# EAGLE design m2101-psu-dcdc (EAGLE 7.5.0)
Assembly variants: 9V-36V Input (Pos ON), 9V-36V Input (Neg ON), +15V/0/-15V Input
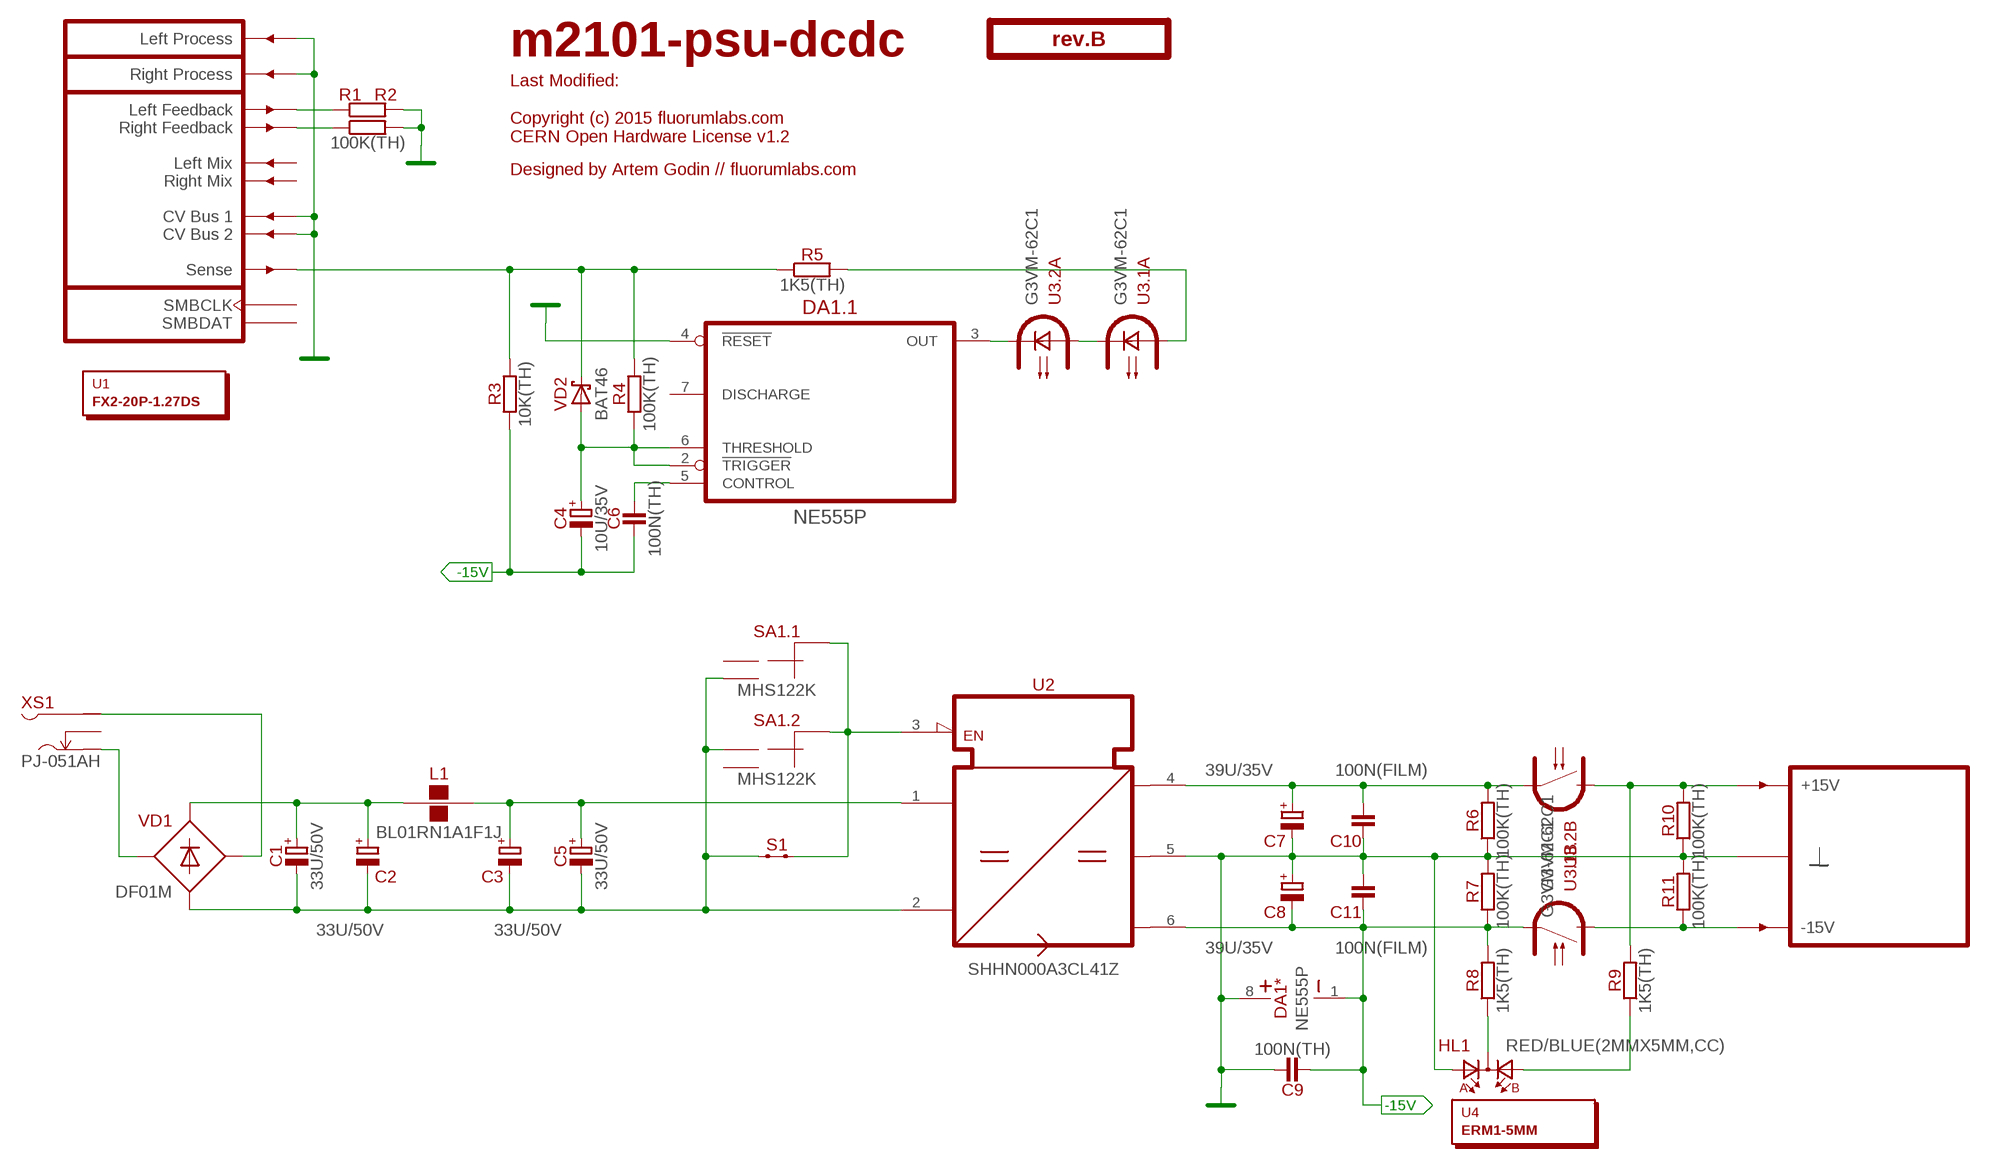
[diagram p0: schematic, sheet 1]

## Parts
C1  33U/50V  [E3,5-8]
C2  33U/50V  [E3,5-8]  (not fitted in variant +15V/0/-15V Input)
C3  33U/50V  [E3,5-8]  (not fitted in variant +15V/0/-15V Input)
C4  10U/35V  [E2-5]
C5  33U/50V  [E3,5-8]
C6  100N(TH)  [C050-024X044]
C7  39U/35V  [E3,5-8]
C8  39U/35V  [E3,5-8]
C9  100N(TH)  [C050-024X044]
C10  100N(FILM)  [C050-025X075]
C11  100N(FILM)  [C050-025X075]
DA1  NE555P  [DIP-8]
HL1  RED/BLUE(2MMX5MM,CC)  [LED2X5-3PIN]
L1  BL01RN1A1F1J  [BL01RN1A]  (not fitted in variant +15V/0/-15V Input)
O1  Designed by Artem Godin // fluorumlabs.com  TITLE  [EMPTY]
PCB1  rev.B  ST2-BOARD-50-PSU  [ST2-BOARD-50-PSU]
R1  100K(TH)  [R-0207/10]
R2  100K(TH)  [R-0207/10]
R3  10K(TH)  [R-0207/10]
R4  100K(TH)  [R-0207/10]
R5  1K5(TH)  [R-0207/10]
R6  100K(TH)  [R-0207/10]
R7  100K(TH)  [R-0207/10]
R8  1K5(TH)  [R-0207/10]
R9  1K5(TH)  [R-0207/10]
R10  100K(TH)  [R-0207/10]
R11  100K(TH)  [R-0207/10]
S1  JUMPER-1POS-SOLDER  [JP1-SOLDER]
SA1  MHS122K  [APEM-MHS122K]
U1  FX2-20P-1.27DS  [EMPTY]
U2  SHHN000A3CL41Z  [DC/DC-C1]  (not fitted in variant +15V/0/-15V Input)
U3  G3VM-62C1  [DIL08]
U4  ERM1-5MM  [EMPTY]
VD1  DF01M  [MDIP-4]
VD2  BAT46  [DO35-7]
XS1  PJ-051AH  [PJ-051AH]

## Nets
-15V: C4.- C6.1 C8.- C9.1 C11.1 DA1.1(*:V-) R3.1 R7.1 R8.2 U2.6(V-) U3.7(.1B:S2)
GND: C7.- C8.+ C9.2 C10.1 C11.2 DA1.4(.1:!RESET) DA1.8(*:V+) HL1.A1 PCB1.ACV1'(CV1') PCB1.ACV2'(CV2') PCB1.B4'(GND) PCB1.B5'(GND) PCB1.B6'(GND) PCB1.B7'(GND) PCB1.B8'(GND) PCB1.BOUTL'(OUTL) PCB1.BOUTR'(OUTR) R1.2 R2.2 R6.1 R7.2 R10.1 R11.2 U2.5(GND)
N$1: R5.2 U3.1(.1A:A)
N$2: VD1.1(AC1) XS1.3(S)
N$3: C1.- C2.- C3.- C5.- S1.1 SA1.1' SA1.2 U2.2(IN-) VD1.4(A)
N$4: PCB1.ALFBK'(LFBK') R1.1
N$5: PCB1.ARFBK'(RFBK') R2.1
N$6: C6.2 DA1.5(.1:CONTROL)
N$7: DA1.3(.1:OUT) U3.4(.2A:C)
N$8: PCB1.A+15'(P+15V) PCB1.B+15'(P+15V) R9.2 R10.2 U3.6(.2B:S1)
N$9: U3.2(.1A:C) U3.3(.2A:A)
N$10: C4.+ DA1.2(.1:!TRIGGER) DA1.6(.1:THRESHOLD) R4.1 VD2.A
N$11: VD1.2(AC2) XS1.1(P)
N$12: PCB1.A-15'(P-15V) PCB1.B-15'(P-15V) R11.1 U3.8(.1B:S1)
N$13: HL1.K R8.1
N$14: HL1.A2 R9.1
N$15: C7.+ C10.2 R6.2 U2.4(V+) U3.5(.2B:S2)
N$16: S1.2 SA1.CMN'(.2:CM) SA1.CMN(.1:CM) U2.3(EN)
N$20: C1.+ C2.+ L1.1 VD1.3(C)
N$22: C3.+ C5.+ L1.2 U2.1(IN+)
SENSE: PCB1.BSENSE'(SENSE') R3.2 R4.2 R5.1 VD2.C
Unconnected: DA1.7(.1:DISCHARGE) PCB1.ALMIX'(LMIX') PCB1.ARMIX'(RMIX') PCB1.ASMBCLK'(SMBCLK) PCB1.ASMBDAT'(SMBDAT) SA1.1 SA1.2' XS1.2(SS)

## Library data of the parts
C1-C3 C5 = capacitors-electrolytic:?; MOUSER: 661-EKZE500ELL330MH0
C4 = capacitors-electrolytic:?; MOUSER: 647-USW1V100MDD
C6 C9 = capacitors:?; MOUSER: 81-RCER71H104K0A2H3B
C7 C8 = capacitors-electrolytic:?; MOUSER: 667-35SEPF39M
C10 C11 = capacitors:?; MOUSER: 505-MKS2.1/63/5
DA1 = ic-logic:NE555?; MOUSER: 595-NE555P
HL1 = optoelectronics:?(2MMX5MM,CC)
L1 = inductors:BL01RN1A?; MOUSER: 81-BL01RN1A1F1J
O1 = text:TITLE
PCB1 = module-footprints:ST2-BOARD-50-PSU
R1 R2 R4 R6 R7 R10 R11 = resistors:?; MOUSER: 71-RN55D-F-100K
R3 = resistors:?; MOUSER: 71-RN55D-F-10K
R5 R8 R9 = resistors:?; MOUSER: 71-CCF071K50GKE36
S1 = switches:JUMPER-1POS-SOLDER
SA1 = switches:MHS122K; MOUSER: 642-MHS122K
U1 = hardware:?; MOUSER: 798-FX2-20P-1.27DS71
U2 = regulators-switch-mode:SHHN000A3CL41Z; MOUSER: 894-SHHN000A3CL41Z
U3 = optoelectronics:G3VM-?2C; MOUSER: 653-G3VM-62C1
U4 = hardware:?
VD1 = diodes:DF?M; MOUSER: 512-DF01M
VD2 = diodes-schottky:?; MOUSER: 511-BAT46
XS1 = connectors:PJ-051?; MOUSER: 490-PJ-051AH

## Board
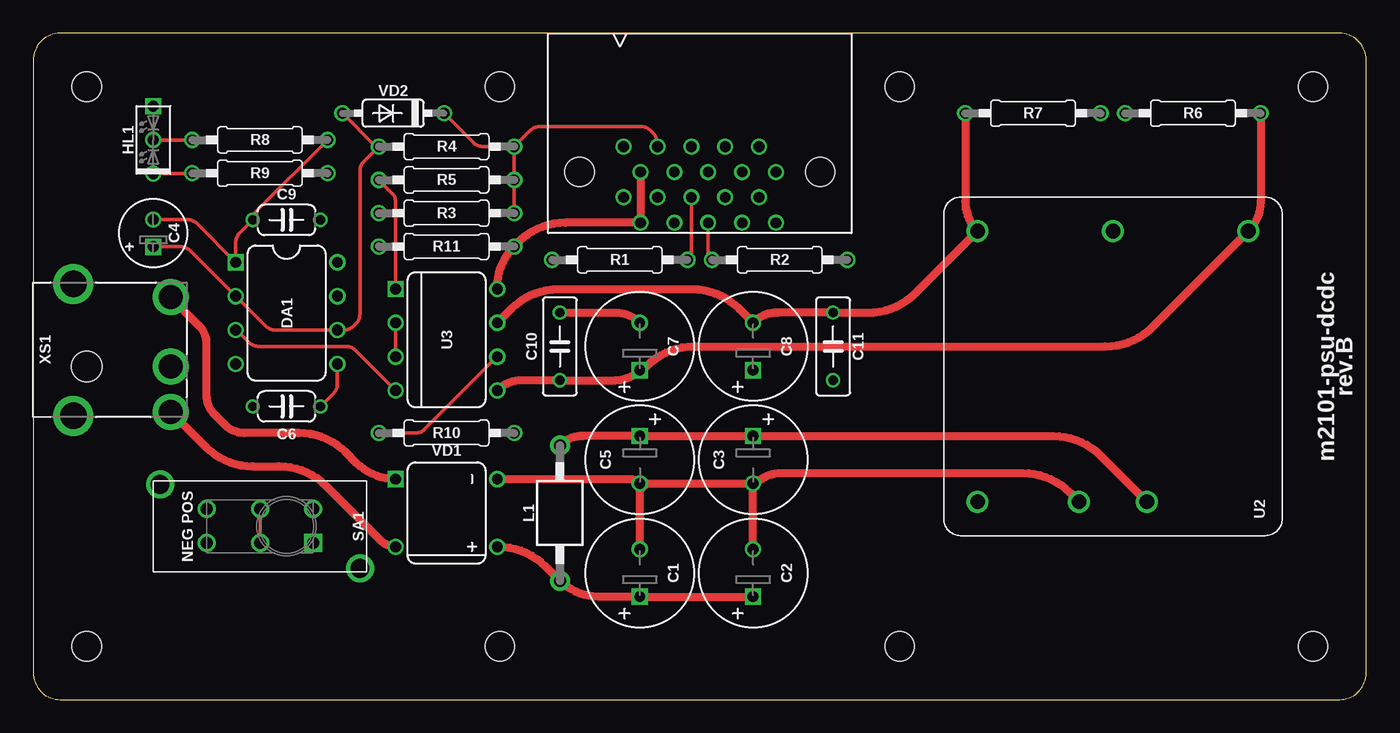
[diagram p1: board, top side]
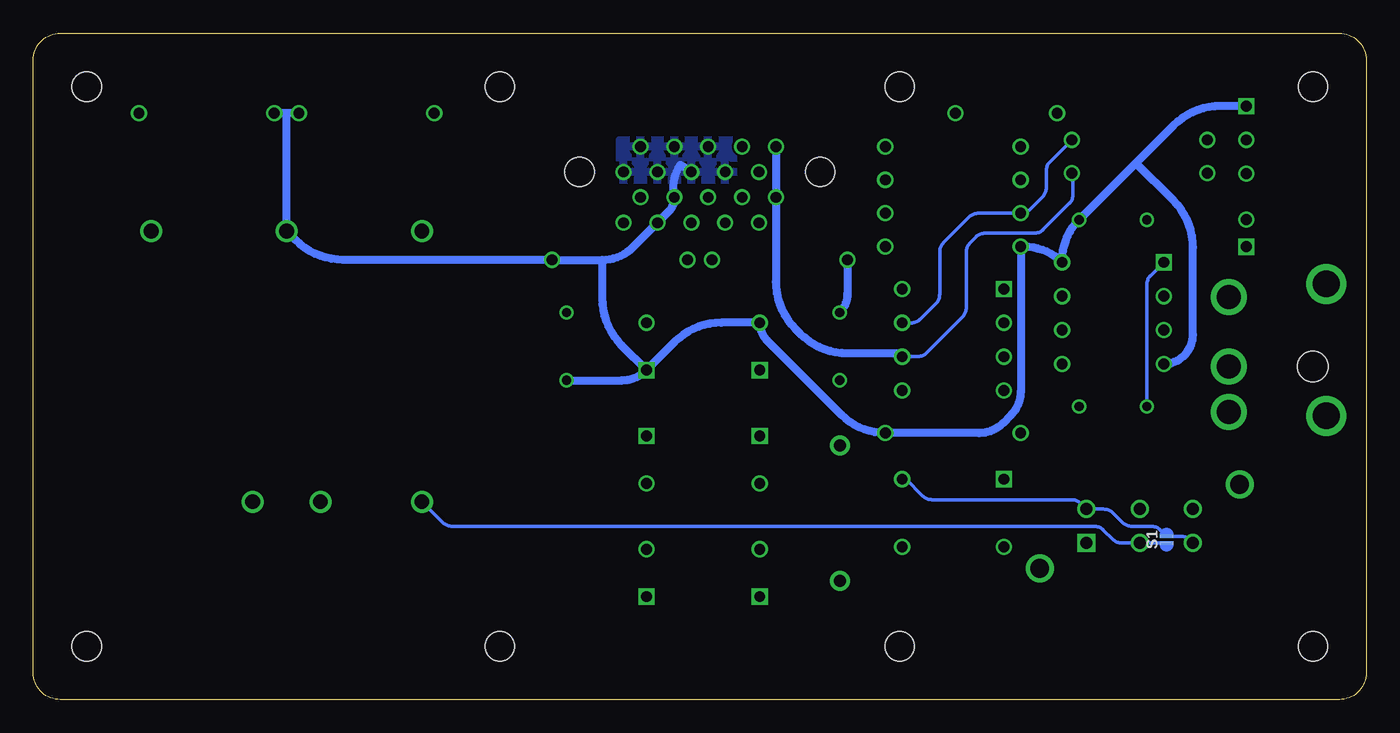
[diagram p2: board, bottom side, seen from below]

Size 100 x 50 mm. Coordinates in mm from the lower left corner, seen from the top.
Outline: 0,48 0,2 arc90 2,0 98,0 arc90 100,2 100,48 arc90 98,50 2,50 arc90 0,48
Copper layers (1*16): Top 0.0356mm / dielectric 1.5011mm / Bottom 0.0356mm
Design rules "LaenPCBOrder": minimum track width 6mil, minimum drill 13mil, track to track 6mil, track to pad 6mil, pad to pad 6mil, via to via 6mil, smd to smd 6mil, copper to edge 15mil, drill to drill 6mil, minimum pad ring 7mil, minimum via ring 7mil, stop-mask expansion 3mil, vias tented up to drill 0mil, thermal gap 10mil

### Footprints (pad centres in the part's own frame; a part is rotated, then mirrored left to right if it is on the bottom)
E3,5-8 = drill 0.813 square: + -1.778,0 | drill 0.813: - 1.778,0
E2-5 = drill 0.813 square: + -1.016,0 | drill 0.813: - 1.016,0
C050-024X044 = drill 0.7: 1 -2.54,0; 2 2.54,0
C050-025X075 = drill 0.7: 1 -2.54,0; 2 2.54,0
DIP-8 = drill 0.813 square: 1 -3.81,-3.81 | drill 0.813: 2 -1.27,-3.81; 3 1.27,-3.81; 4 3.81,-3.81; 5 3.81,3.81; 6 1.27,3.81; 7 -1.27,3.81; 8 -3.81,3.81
LED2X5-3PIN = drill 0.813 square: A1 -2.54,0 | drill 0.813: A2 2.54,0; K 0,0
BL01RN1A = drill 0.9 pad 1.5: 1 -5.08,0; 2 5.08,0
ST2-BOARD-50-PSU = drill 0.8: A+15' 44.285,37.69; A-15' 45.555,35.785; ACV1' 51.905,37.69; ACV2' 53.175,35.785; ALFBK' 49.365,37.69; ALMIX' 46.825,37.69; ARFBK' 50.635,35.785; ARMIX' 48.095,35.785; ASMBCLK' 55.715,35.785; ASMBDAT' 54.445,37.69; B4' 48.095,39.595; B5' 49.365,41.5; B6' 50.635,39.595; B7' 51.905,41.5; B8' 53.175,39.595; B+15' 44.285,41.5; B-15' 45.555,39.595; BOUTL' 54.445,41.5; BOUTR' 55.715,39.595; BSENSE' 46.825,41.5 | hole 2.2: 4,4; 4,46; 96,4; 96,46; 35,46; 65,46; 65,4; 35,4; 40.975,39.595; 59.025,39.595
R-0207/10 = drill 0.813: 1 -5.08,0; 2 5.08,0
JP1-SOLDER = smd 0.254 x 1.016: 1 -0.254,0.026; 2 0.254,0.026
APEM-MHS122K = drill 0.9 square: 1 -4,1.25 | drill 0.9: 1' -4,-1.29; 2 4,1.25; 2' 4,-1.29; CMN 0,1.25; CMN' 0,-1.29 | drill 1.4: S1 -7.5,3.15; S2 7.5,-3.15
DC/DC-C1 = drill 1.1: 1 -10.16,-2.54; 2 -10.16,2.54; 3 -10.16,10.16; 4 10.16,-10.16; 5 10.16,0; 6 10.16,10.16
DIL08 = drill 0.813 square: 1 -3.81,-3.81 | drill 0.813: 2 -1.27,-3.81; 3 1.27,-3.81; 4 3.81,-3.81; 5 3.81,3.81; 6 1.27,3.81; 7 -1.27,3.81; 8 -3.81,3.81
MDIP-4 = drill 0.813 square: 1 -2.54,-3.81 | drill 0.813: 2 2.54,-3.81; 3 2.54,3.81; 4 -2.54,3.81
DO35-7 = drill 0.813: A 3.81,0; C -3.81,0
PJ-051AH = drill 1.8: 1 10.3,-3.4; 2 10.3,0; 3 10.3,5.2 | drill 2: S1 3,6.2; S2 3,-3.7 | hole 2.3: 4,0

### Placement (x,y rotation side)
C1  45.5,9.5 90 top
C2  54,9.5 90 top
C3  54,18 270 top
C4  9,35 90 top
C5  45.5,18 270 top
C6  19,22 0 top
C7  45.5,26.5 90 top
C8  54,26.5 90 top
C9  19,36 0 top
C10  39.5,26.5 270 top
C11  60,26.5 270 top
DA1  19,29 270 top
HL1  9,42 270 top
L1  39.5,14 90 top
O1  -78.74,95.25 0 top  (outside the outline)
PCB1  0,0 0 top
R1  44,33 180 top
R2  56,33 0 top
R3  31,36.5 0 top
R4  31,41.5 0 top
R5  31,39 180 top
R6  87,44 0 top
R7  75,44 0 top
R8  17,42 0 top
R9  17,39.5 0 top
R10  31,20 180 top
R11  31,34 180 top
S1  15,12 270 bottom
SA1  17,13 180 top
U1  -81,-99 0 top  (outside the outline)
U2  81,25 90 top
U3  31,27 270 top
U4  -82,-101 0 top  (outside the outline)
VD1  31,14 270 top
VD2  27,44 180 top
XS1  0,25 0 top

### Tracks (layer width: path | path; a pad name or v marks a point on that pad's centre or on a via)
-15V
  Top 0.254: C4.- 11.57,36.02 arc-45 12.28,35.72 DA1.1 15.19,34.32 arc-45 15.48,35.02 C9.1 arc-45 16.73,36.65 R8.2
  Top 0.61: U3.7 35.85,29.31 arc-45 39.38,30.77 49.44,30.77 arc-45 52.97,29.31 C8.- arc-45 55.84,29.04 C11.1 62.65,29.04 arc45 66.18,30.5 U2.6 arc-45 69.92,37.38 R7.1
  Bottom 0.254: C6.1 16.46,31.13 arc45 16.17,31.83 DA1.1 | R8.2 23.71,40.37 arc-45 24,39.67 24,38.41 arc45 24.29,37.71 25.21,36.79 arc45 R3.1 29.09,36.5 arc-45 29.79,36.21 31.71,34.29 arc-45 32,33.59 32,30.41 arc45 32.29,29.71 33.44,28.56 arc45 34.14,28.27 U3.7
GND
  Top 0.61: C10.1 43.66,29.04 arc-45 C7.-
  Bottom 0.61: R7.2 81,44 | 81,44 R6.1 82,44 | 81,44 U2.5 80.3,34.46 arc-45 76.77,33 R2.2 57.32,33 | HL1.A1 10.93,44.54 arc-45 14.46,43.08 17.27,40.27 | 17.27,40.27 C9.2 arc-45 22.81,32.93 DA1.8 arc-45 25.68,34 R11.2 25.92,23.12 arc45 26.65,21.35 27.27,20.73 arc45 29.04,20 R10.1 arc45 39.36,21.36 44.95,26.95 arc45 C7.- 48.37,28.28 arc-45 51.91,26.81 C8.+ | DA1.4 arc-90 13,27.38 13,33.93 arc-45 14.46,37.46 17.27,40.27 | R1.2 38.92,30.44 arc45 C10.1 | C11.2 55.84,23.96 arc-45 C8.+ | 57.32,33 57.32,30.11 arc-45 55.85,26.57 C8.+ | PCB1.B6' 51.46,40.13 arc-45 PCB1.ACV1' arc45 52.35,36.61 PCB1.ACV2' 55,33.96 arc45 57.32,33
  pour Bottom: 47.5,42 47.5,39 56,39 56,42
N$1
  Top 0.254: U3.1 27.19,37.32 arc45 26.9,38.02 R5.2
N$2
  Top 0.61: VD1.1 arc-45 24.24,17.76 23.46,18.54 arc45 19.93,20 15.83,20 arc-45 14.41,20.59 13.59,21.41 arc-45 13,22.83 13,26.67 arc45 12.41,28.09 XS1.3
N$3
  Top 0.61: VD1.4 44.73,16.54 arc-45 C5.- 46,16.22 | 46,16.22 C3.- | C1.- 45.5,15.72 46,16.22 | C2.- C3.- | C3.- 54.22,16.22 arc-45 56.1,17 74.23,17 arc-45 77.76,15.54 U2.2
  Bottom 0.254: VD1.4 34.54,16.54 33.29,15.29 arc-45 32.59,15 22.12,15 arc45 21.42,14.71 SA1.1' 19.7,14.29 arc45 19,14 18.29,13.29 arc-45 17.59,13 16.13,13 arc45 15.43,12.71 S1.1 13.92,12.25 arc45 13.21,11.96 SA1.2
N$4
  Top 0.254: PCB1.ALFBK' 49.37,33.28 R1.1
N$5
  Top 0.254: PCB1.ARFBK' 50.63,33.28 R2.1
N$6
  Top 0.254: DA1.5 22.81,23.68 arc-45 22.52,22.98 C6.2
N$7
  Top 0.254: DA1.3 15.27,27.73 16.21,26.79 arc45 16.91,26.5 23.47,26.5 arc-45 24.17,26.21 U3.4
N$8
  Top 0.254: R10.2 28.67,20 arc45 29.37,20.29 U3.6
  Bottom 0.254: U3.6 33.68,25.73 arc-45 32.98,26.02 30.29,28.71 arc-45 30,29.41 30,33.59 arc45 29.71,34.29 29.29,34.71 arc45 28.59,35 24.91,35 arc-45 24.21,35.29 22.29,37.21 arc-45 22,37.91 22,39.42 R9.2
  Bottom 0.61: PCB1.B+15' PCB1.A+15' 44.28,31.36 arc-45 42.82,27.82 42.46,27.46 arc-45 38.93,26 35.08,26 U3.6
N$9
  Top 0.254: U3.2 U3.3
N$10
  Top 0.254: C4.+ 11.06,33.98 arc-45 11.77,33.69 DA1.2 17.44,28.02 arc45 18.14,27.73 DA1.6 23.32,27.73 arc45 24.02,28.02 24.21,28.21 arc45 24.5,28.91 24.5,39.67 arc-45 24.79,40.37 R4.1 25.69,41.5 VD2.A
N$11
  Top 0.61: XS1.1 12.94,18.96 arc45 16.47,17.5 18.43,17.5 arc-45 21.96,16.04 26.04,11.96 arc45 27.15,11.5 VD1.2
N$12
  Top 0.61: PCB1.B-15' PCB1.A-15' 39.94,35.78 arc45 36.4,34.32 R11.1 arc45 34.81,30.93 U3.8
N$13
  Top 0.254: HL1.K R8.1
N$14
  Top 0.254: HL1.A2 11.88,39.46 R9.1
N$15
  Top 0.61: R6.2 92.08,37.38 arc-45 U2.4 83.96,27.96 arc-45 80.43,26.5 49.57,26.5 arc45 46.04,25.04 45.88,24.88 arc-45 C7.+ arc-45 43.66,23.96 C10.2 36.67,23.96 arc45 U3.5
N$16
  Top 0.254: SA1.CMN SA1.CMN'
  Bottom 0.254: U2.3 69.29,13.29 arc-45 68.59,13 20.41,13 arc45 19.71,12.71 19.04,12.04 arc-45 18.34,11.75 SA1.CMN S1.2 | 16.96,14.25 SA1.CMN'
N$20
  Top 0.61: C2.+ C1.+ 42.39,7.72 arc-45 L1.1 38.42,10 arc45 34.89,11.46 VD1.3
N$22
  Top 0.61: L1.2 arc-45 41.19,19.78 C5.+ C3.+ 76.53,19.78 arc-45 80.07,18.31 U2.1
SENSE
  Top 0.254: R4.2 R5.1 R3.2 | R4.2 33.72,41.5 arc-45 33.02,41.79 VD2.C | PCB1.BSENSE' 46.83,41.76 arc45 46.53,42.47 46.29,42.71 arc45 45.59,43 37.99,43 arc45 37.29,42.71 R4.2

### Text on the board
tPlace: NEG POS